# EAGLE design SEMAFORO MOSFET 2 (EAGLE 7.3.0)

## Sheet 1 of 2
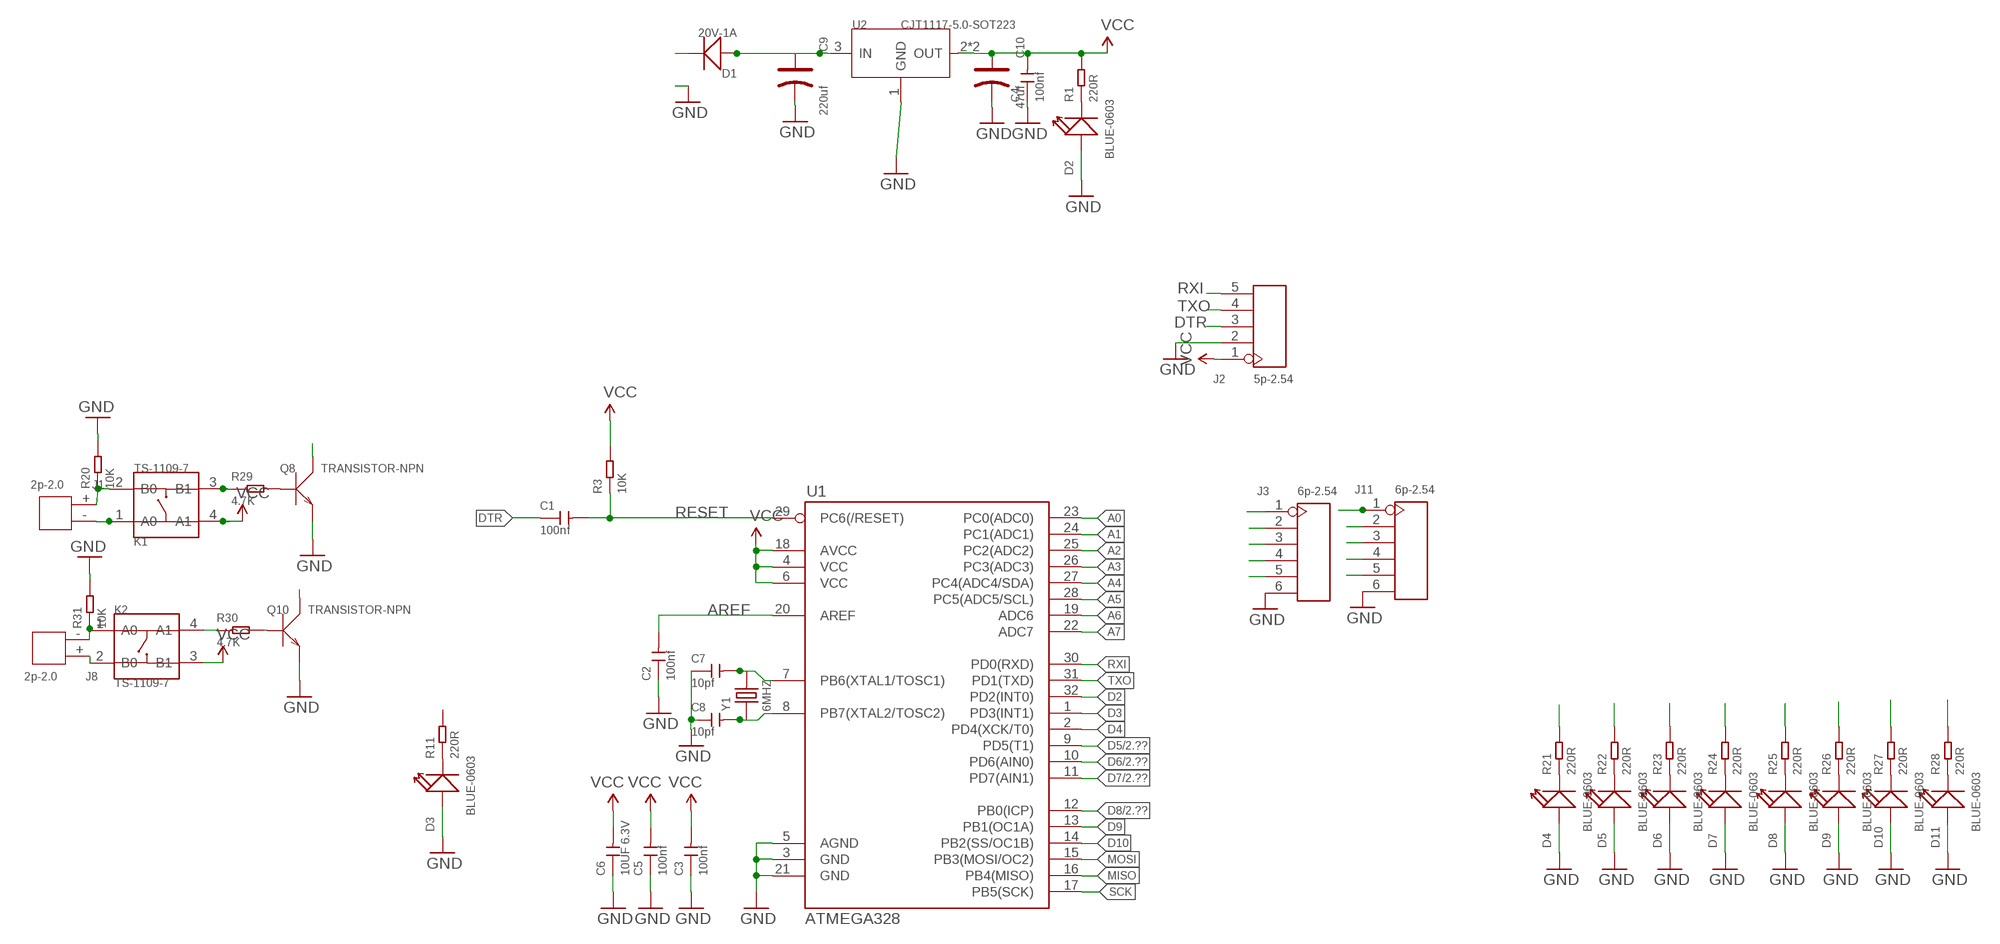
[diagram p0: schematic, sheet 1]

### Parts
C1  100nf  CERAMIC-100NF-50V-10%-X7R(0603)  [C0603]
C2  100nf  CERAMIC-100NF-50V-10%-X7R(0603)  [C0603]
C3  100nf  CERAMIC-100NF-50V-10%-X7R(0603)  [C0603]
C4  100nf  CERAMIC-100NF-50V-10%-X7R(0603)  [C0603]
C5  100nf  CERAMIC-100NF-50V-10%-X7R(0603)  [C0603]
C6  10UF 6.3V  CERAMIC-10UF-6.3V-20%-X5R(0603)  [C0603]
C7  10pf  CERAMIC-10PF-50V-5%-NPO(0603)  [C0603]
C8  10pf  CERAMIC-10PF-50V-5%-NPO(0603)  [C0603]
C9  220uf  DIP-ALUMINUM-100UF-16V(D5-H7MM)  [PC-D5.3MM]
C10  47uf  DIP-ALUMINUM-100UF-16V(D5-H7MM)  [PC-D5.3MM]
D1  20V-1A  SMD-DIODE-SCHOTTKY-20V-1A(SOD-123)  [SOD-123]
D2  BLUE-0603  SMD-LED-CLEAR-BLUE(0603)  [LED-0603]
D3  BLUE-0603  SMD-LED-CLEAR-BLUE(0603)  [LED-0603]
D4  BLUE-0603  SMD-LED-CLEAR-BLUE(0603)  [LED-0603]
D5  BLUE-0603  SMD-LED-CLEAR-BLUE(0603)  [LED-0603]
D6  BLUE-0603  SMD-LED-CLEAR-BLUE(0603)  [LED-0603]
D7  BLUE-0603  SMD-LED-CLEAR-BLUE(0603)  [LED-0603]
D8  BLUE-0603  SMD-LED-CLEAR-BLUE(0603)  [LED-0603]
D9  BLUE-0603  SMD-LED-CLEAR-BLUE(0603)  [LED-0603]
D10  BLUE-0603  SMD-LED-CLEAR-BLUE(0603)  [LED-0603]
D11  BLUE-0603  SMD-LED-CLEAR-BLUE(0603)  [LED-0603]
J1  2p-2.0  DIP-JST-2P-2.0  [H2-2.0-6X4.5MM]
J2  5p-2.54  DIP-BLACK-FEMALE-HEADER-VERT(5P-2.54)  [H5-2.54]
J3  6p-2.54  DIP-LONG-BLUE-FEMALE-HEADER(6P-2.54)  [H6-2.54]
J8  2p-2.0  DIP-JST-2P-2.0  [H2-2.0-6X4.5MM]
J11  6p-2.54  DIP-LONG-BLUE-FEMALE-HEADER(6P-2.54)  [H6-2.54]
K1  TS-1109-7  DIP-BUTTON-TOP-BLACK(4P-D6.2MM)  [SW4-6.2X6.2X5.0MM]
K2  TS-1109-7  DIP-BUTTON-TOP-BLACK(4P-D6.2MM)  [SW4-6.2X6.2X5.0MM]
Q8  TRANSISTOR-NPN  [SOT-23]
Q10  TRANSISTOR-NPN  [SOT-23]
R1  220R  SMD-RES-220R-5%-1/10W(0603)  [R0603]
R3  10K  SMD-RES-10K-1%-1/10W(0603)  [R0603]
R11  220R  SMD-RES-220R-5%-1/10W(0603)  [R0603]
R20  10K  SMD-RES-10K-1%-1/10W(0603)  [R0603]
R21  220R  SMD-RES-220R-5%-1/10W(0603)  [R0603]
R22  220R  SMD-RES-220R-5%-1/10W(0603)  [R0603]
R23  220R  SMD-RES-220R-5%-1/10W(0603)  [R0603]
R24  220R  SMD-RES-220R-5%-1/10W(0603)  [R0603]
R25  220R  SMD-RES-220R-5%-1/10W(0603)  [R0603]
R26  220R  SMD-RES-220R-5%-1/10W(0603)  [R0603]
R27  220R  SMD-RES-220R-5%-1/10W(0603)  [R0603]
R28  220R  SMD-RES-220R-5%-1/10W(0603)  [R0603]
R29  4.7K  SMD-RES-4.7K-5%-1/10W(0603)  [R0603]
R30  4.7K  SMD-RES-4.7K-5%-1/10W(0603)  [R0603]
R31  10K  SMD-RES-10K-1%-1/10W(0603)  [R0603]
U1  ATMEGA328  ATMEGA168  [TQFP32-08]
U2  CJT1117-5.0-SOT223  PMIC-CJT1117-5.0(SOT223)  [SOT-223]
Y1  6MHZ  DIP-CRYSTAL-6MHZ-32PF-30PPM-100R(HC49US)  [HC49US]

### Nets
3.3V: K1.4(A1) K2.3(B1) ; supply symbol labelled VCC
A0: J11.3 U1.23(PC0(ADC0))
A1: J11.2 U1.24(PC1(ADC1))
A2: J3.5 U1.25(PC2(ADC2))
A3: J3.4 U1.26(PC3(ADC3))
A4: J3.3 U1.27(PC4(ADC4/SDA))
A5: J3.2 U1.28(PC5(ADC5/SCL))
A6: J11.5 U1.19(ADC6)
A7: J11.4 U1.22(ADC7)
AREF: C2.2 U1.20(AREF)
D2: Q8.3(C) U1.32(PD2(INT0))
D3: U1.1(PD3(INT1))
D4: U1.2(PD4(XCK/T0))
D5: R21.2 U1.9(PD5(T1)) ; also sheet 2
D6: R22.2 U1.10(PD6(AIN0)) ; also sheet 2
D7: R23.2 U1.11(PD7(AIN1)) ; also sheet 2
D8: R24.2 U1.12(PB0(ICP)) ; also sheet 2
D9: R25.2 U1.13(PB1(OC1A)) ; also sheet 2
D10: R28.2 U1.14(PB2(SS/OC1B)) ; also sheet 2
D22: J1.+ K1.2(B0) R20.1
DTR: C1.1 J2.3
GND [vcc]: C2.1 C3.1 C4.1 C5.1 C6.1 C7.1 C8.1 C9.- C10.- D2.+ D3.+ D4.+ D5.+ D6.+ D7.+ D8.+ D9.+ D10.+ D11.+ J2.2 J3.6 J11.6 Q8.2(E) Q10.2(E) R20.2 R31.2 U1.3(GND) U1.5(AGND) U1.21(GND) U2.1(GND) ; also sheet 2
MISO: R26.2 U1.16(PB4(MISO)) ; also sheet 2
MOSI: R27.2 U1.15(PB3(MOSI/OC2)) ; also sheet 2
N$1: C8.2 U1.8(PB7(XTAL2/TOSC2)) Y1.1
N$2: C7.2 U1.7(PB6(XTAL1/TOSC1)) Y1.2
N$5: D2.- R1.1
N$7: D4.- R21.1
N$12: C9.+ D1.+ U2.3(IN)
N$13: D3.- R11.1
N$15: J8.- K2.1(A0) R31.1
N$16: J8.+ K2.2(B0)
N$18: D5.- R22.1
N$19: D6.- R23.1
N$21: D7.- R24.1
N$22: D8.- R25.1
N$23: D9.- R26.1
N$24: D10.- R27.1
N$25: D11.- R28.1
N$27: D1.-
N$40: K2.4(A1) R30.1
N$41: K1.3(B1) R29.1
N$42: Q10.1(B) R30.2
N$43: Q8.1(B) R29.2
RESET: C1.2 Q10.3(C) R3.1 U1.29(PC6(/RESET))
RXI: J2.5 U1.30(PD0(RXD))
SCK: U1.17(PB5(SCK))
TXO: J2.4 U1.31(PD1(TXD))
VCC: C3.2 C4.2 C5.2 C6.2 C10.+ J1.- J2.1 J3.1 J11.1 K1.1(A0) R1.2 R3.2 U1.4(VCC) U1.6(VCC) U1.18(AVCC) U2.2(OUT) U2.TER(OUT)
Unconnected: R11.2

## Sheet 2 of 2
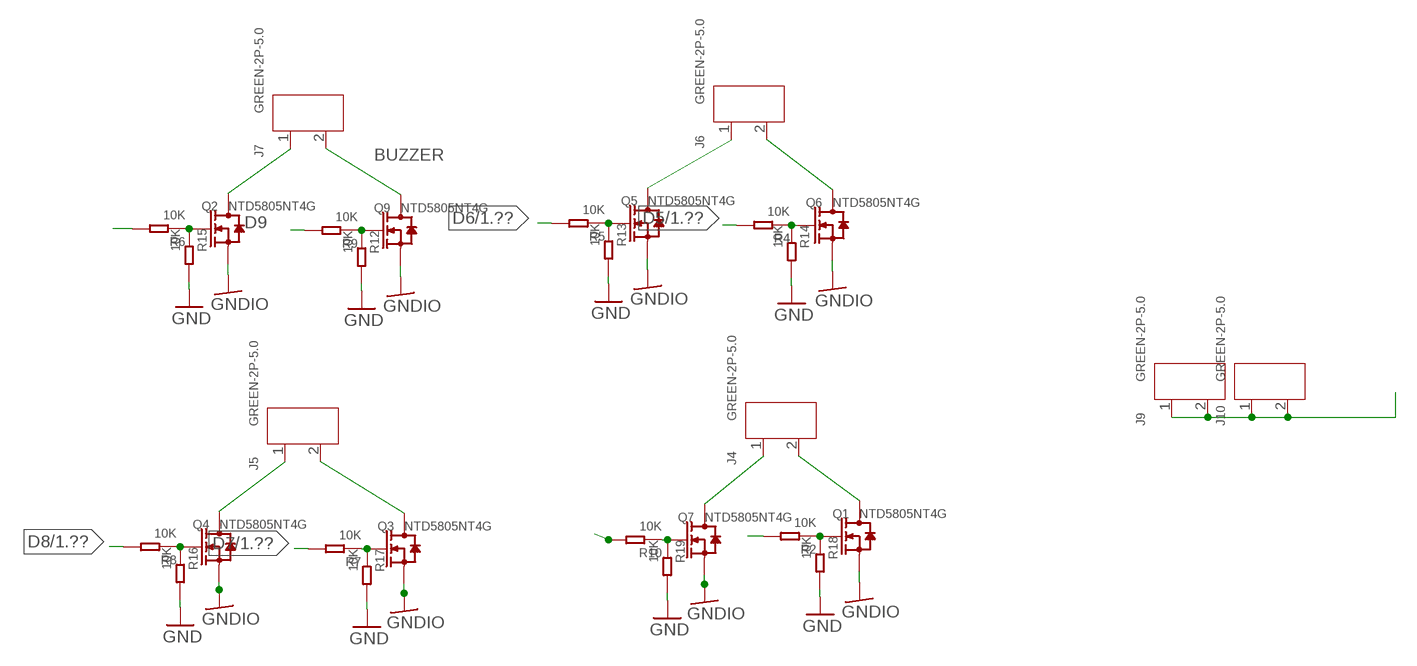
[diagram p1: schematic, sheet 2]

### Parts
J4  GREEN-2P-5.0  SCREW-TERMINAL-GREEN(2P-5.0)  [H2-5.0-10.5X8.0MM]
J5  GREEN-2P-5.0  SCREW-TERMINAL-GREEN(2P-5.0)  [H2-5.0-10.5X8.0MM]
J6  GREEN-2P-5.0  SCREW-TERMINAL-GREEN(2P-5.0)  [H2-5.0-10.5X8.0MM]
J7  GREEN-2P-5.0  SCREW-TERMINAL-GREEN(2P-5.0)  [H2-5.0-10.5X8.0MM]
J9  GREEN-2P-5.0  SCREW-TERMINAL-GREEN(2P-5.0)  [H2-5.0-10.5X8.0MM]
J10  GREEN-2P-5.0  SCREW-TERMINAL-GREEN(2P-5.0)  [H2-5.0-10.5X8.0MM]
Q1  NTD5805NT4G  SMD-MOSFET-HIGH-POWER-N-CH-40V-51A-NTD5805NT4G(DPAK)  [DPAK]
Q2  NTD5805NT4G  SMD-MOSFET-HIGH-POWER-N-CH-40V-51A-NTD5805NT4G(DPAK)  [DPAK]
Q3  NTD5805NT4G  SMD-MOSFET-HIGH-POWER-N-CH-40V-51A-NTD5805NT4G(DPAK)  [DPAK]
Q4  NTD5805NT4G  SMD-MOSFET-HIGH-POWER-N-CH-40V-51A-NTD5805NT4G(DPAK)  [DPAK]
Q5  NTD5805NT4G  SMD-MOSFET-HIGH-POWER-N-CH-40V-51A-NTD5805NT4G(DPAK)  [DPAK]
Q6  NTD5805NT4G  SMD-MOSFET-HIGH-POWER-N-CH-40V-51A-NTD5805NT4G(DPAK)  [DPAK]
Q7  NTD5805NT4G  SMD-MOSFET-HIGH-POWER-N-CH-40V-51A-NTD5805NT4G(DPAK)  [DPAK]
Q9  NTD5805NT4G  SMD-MOSFET-HIGH-POWER-N-CH-40V-51A-NTD5805NT4G(DPAK)  [DPAK]
R2  10K  SMD-RES-10K-1%-1/10W(0603)  [R0603]
R4  10K  SMD-RES-10K-1%-1/10W(0603)  [R0603]
R5  10K  SMD-RES-10K-1%-1/10W(0603)  [R0603]
R6  10K  SMD-RES-10K-1%-1/10W(0603)  [R0603]
R7  10K  SMD-RES-10K-1%-1/10W(0603)  [R0603]
R8  10K  SMD-RES-10K-1%-1/10W(0603)  [R0603]
R9  10K  SMD-RES-10K-1%-1/10W(0603)  [R0603]
R10  10K  SMD-RES-10K-1%-1/10W(0603)  [R0603]
R12  10K  SMD-RES-10K-1%-1/10W(0603)  [R0603]
R13  10K  SMD-RES-10K-1%-1/10W(0603)  [R0603]
R14  10K  SMD-RES-10K-1%-1/10W(0603)  [R0603]
R15  10K  SMD-RES-10K-1%-1/10W(0603)  [R0603]
R16  10K  SMD-RES-10K-1%-1/10W(0603)  [R0603]
R17  10K  SMD-RES-10K-1%-1/10W(0603)  [R0603]
R18  10K  SMD-RES-10K-1%-1/10W(0603)  [R0603]
R19  10K  SMD-RES-10K-1%-1/10W(0603)  [R0603]

### Nets
BUZZER: J7.2 Q9.3(D)
D5: R4.2 ; also sheet 1
D6: R5.2 ; also sheet 1
D7: R7.2 ; also sheet 1
D8: R8.2 ; also sheet 1
D9: R9.2 ; also sheet 1
D10: R6.2 ; also sheet 1
GND [vcc]: R12.2 R13.2 R14.2 R15.2 R16.2 R17.2 R18.2 R19.2 ; also sheet 1
GNDIO [vcc]: Q1.2(S) Q2.2(S) Q3.2(S) Q4.2(S) Q5.2(S) Q6.2(S) Q7.2(S) Q9.2(S)
MISO: R10.2 ; also sheet 1
MOSI: R2.2 ; also sheet 1
N$3: J9.1 J9.2 J10.1 J10.2
N$4: J4.1 Q7.3(D)
N$6: Q1.1(G) R2.1 R18.1
N$8: Q6.1(G) R4.1 R14.1
N$9: Q9.1(G) R9.1 R12.1
N$10: Q7.1(G) R10.1 R19.1
N$11: Q5.1(G) R5.1 R13.1
N$14: Q2.1(G) R6.1 R15.1
N$17: Q3.1(G) R7.1 R17.1
N$20: Q4.1(G) R8.1 R16.1
R1: J5.1 Q4.3(D)
R2: J5.2 Q3.3(D)
R3: J6.1 Q5.3(D)
V1: J6.2 Q6.3(D)
V2: J4.2 Q1.3(D)
V3: J7.1 Q2.3(D)

## Library data of the parts
C1-C5 = Seeed-OPL-Capacitor:CERAMIC-100NF-50V-10%-X7R(0603): 302010138; MPN: CC0603KRX7R9BB104
C6 = Seeed-OPL-Capacitor:CERAMIC-10UF-6.3V-20%-X5R(0603): 302010286; MPN: CC0603MRX5R5BB106
C7 C8 = Seeed-OPL-Capacitor:CERAMIC-10PF-50V-5%-NPO(0603): 302010097
C9 C10 = Seeed-OPL-Capacitor:DIP-ALUMINUM-100UF-16V(D5-H7MM): 302030031; VALUE: 100uf
D1 = Seeed-OPL-Diode:SMD-DIODE-SCHOTTKY-20V-1A(SOD-123): 304020034; MPN: B5819W
D2-D11 = Seeed-OPL-Diode:SMD-LED-CLEAR-BLUE(0603): 304090045; MPN: 19-217-BHC-ZL1M2RY-3T
J1 J8 = Seeed-Connector -2016:DIP-JST-2P-2.0: 320110049
J2 = Seeed-OPL-Connector:DIP-BLACK-FEMALE-HEADER-VERT(5P-2.54): 320030028; MPN: F185-1105A0BSYA1
J3 J11 = Seeed-OPL-Connector:DIP-LONG-BLUE-FEMALE-HEADER(6P-2.54): 320030067
J4-J7 J9 J10 = Seeed-Connector -2016:SCREW-TERMINAL-GREEN(2P-5.0): 320110031
K1 K2 = Seeed-OPL-Switch:DIP-BUTTON-TOP-BLACK(4P-D6.2MM): 311020032; MPN: TS-1109-7
Q1-Q7 Q9 = Seeed-OPL-Transistor:SMD-MOSFET-HIGH-POWER-N-CH-40V-51A-NTD5805NT4G(DPAK): 305030078; MPN: NTD5805NT4G
Q8 Q10 = Seeed-OPL-Transistor:TRANSISTOR-NPN*: NPN Transistor
R1 R11 R21-R28 = Seeed-OPL-Resistor:SMD-RES-220R-5%-1/10W(0603): 301010163; MPN: RC0603JR-07220RL
R2-R10 R12-R20 R31 = Seeed-OPL-Resistor:SMD-RES-10K-1%-1/10W(0603): 301010299; MPN: RC0603FR-0710KL
R29 R30 = Seeed-OPL-Resistor:SMD-RES-4.7K-5%-1/10W(0603): 301010290; MPN: RC0603JR-074K7L
U1 = SparkFun:ATMEGA168
U2 = Seeed-OPL-ic:PMIC-CJT1117-5.0(SOT223): 310030096; MPN: CJT1117-5.0
Y1 = Seeed-OPL-Crystal-Oscillator:DIP-CRYSTAL-6MHZ-32PF-30PPM-100R(HC49US): 306010044; MPN: HC49/US

## Net classes
1 vcc: width 0.254 mm

## Board
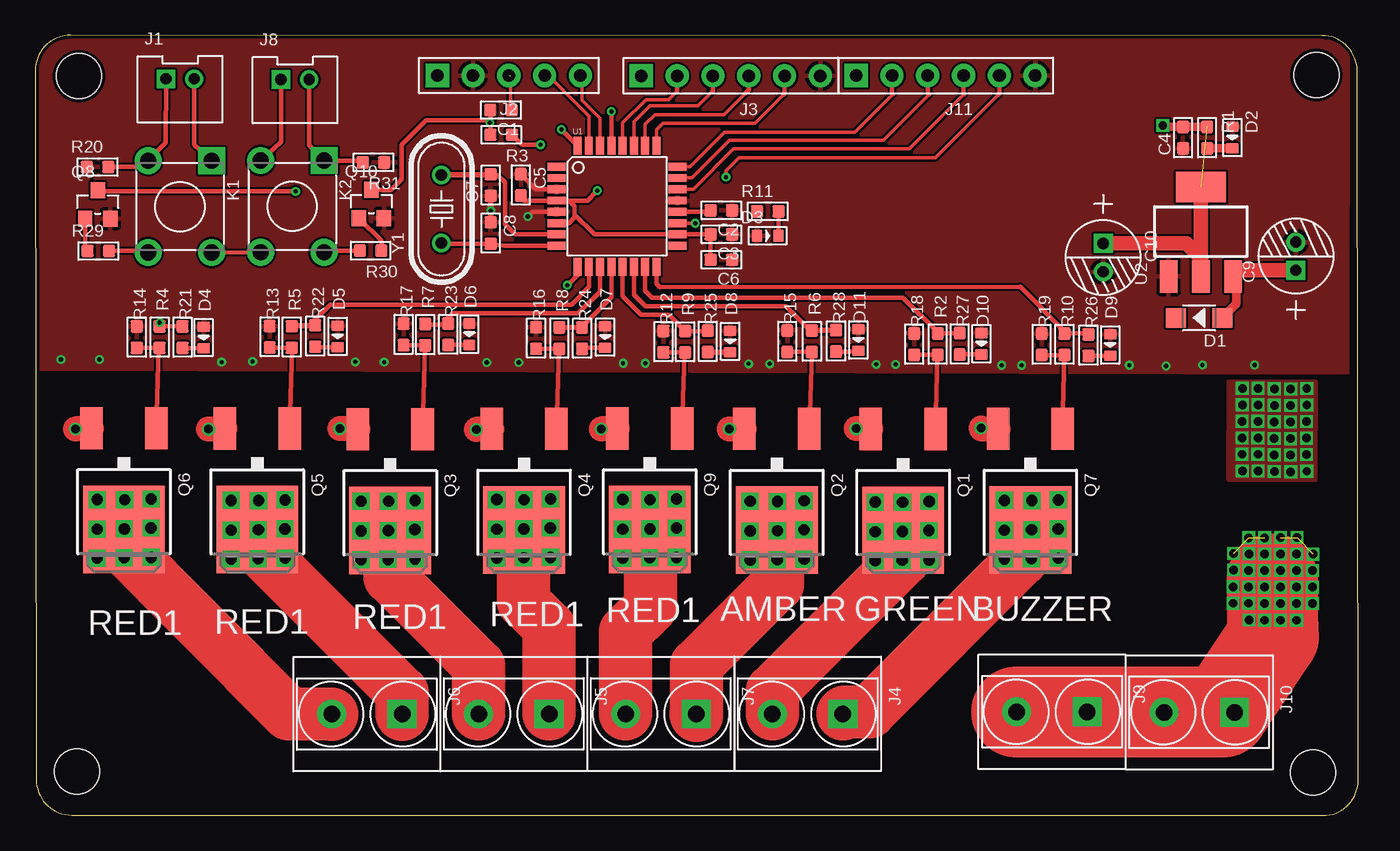
[diagram p2: board, top side]
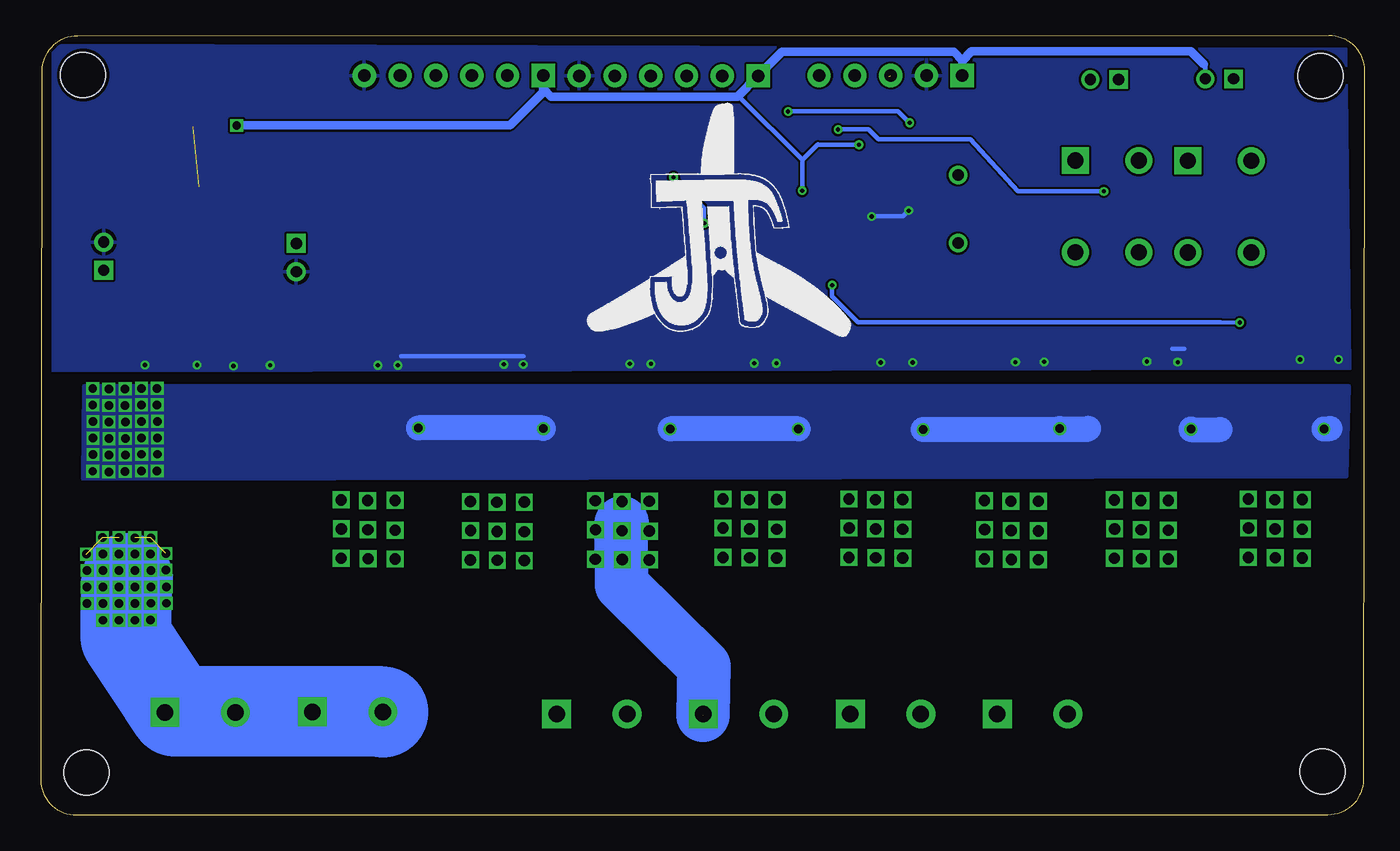
[diagram p3: board, bottom side, seen from below]

Size 93.85 x 55.32 mm. Coordinates in mm from the lower left corner, seen from the top.
Outline: 0,52.82 0.08,2.53 arc90 2.58,0.03 91.35,0 arc90 93.85,2.5 93.78,52.8 arc90 91.28,55.3 2.5,55.32 arc90 0,52.82
Copper layers (1*16): Top 0.035mm / dielectric 1.5mm / Bottom 0.035mm
Design rules "SeeedStudio_2layer_DRU_no_angle_20140221": minimum track width 6mil, minimum drill 12mil, track to track 6mil, track to pad 6mil, pad to pad 6mil, via to via 6mil, smd to smd 0mil, copper to edge 10mil, drill to drill 10mil, minimum pad ring 10mil, minimum via ring 6mil, stop-mask expansion 2mil, vias tented up to drill 100mil, thermal gap 10mil
Holes 3.2 mm at 3.1,52.42 90.88,52.5 90.64,3.05 2.98,3.13

### Footprints (pad centres in the part's own frame; a part is rotated, then mirrored left to right if it is on the bottom)
C0603 = smd 0.889 x 0.889: 1 0,0.762; 2 0,-0.762
PC-D5.3MM = drill 0.8 pad 1.35 square: + -1,0 | drill 0.8 pad 1.35: - 1,0
SOD-123 = smd 1.397 x 1.397: + -1.651,0; - 1.651,0
LED-0603 = smd 0.762 x 0.889: + -0.762,0; - 0.762,0
H2-2.0-6X4.5MM = drill 0.8 pad 1.3 square: + -1,0.75 | drill 0.8 pad 1.3: - 1,0.75
H5-2.54 = drill 0.889 pad 1.651 square: 1 0,5.08 | drill 0.889 pad 1.651: 2 0,2.54; 3 0,0; 4 0,-2.54; 5 0,-5.08
H6-2.54 = drill 0.889 pad 1.651 square: 1 0,6.35 | drill 0.889 pad 1.651: 2 0,3.81; 3 0,1.27; 4 0,-1.27; 5 0,-3.81; 6 0,-6.35
H2-5.0-10.5X8.0MM = drill 1.168 pad 2.032 square: 1 0,2.5 | drill 1.168 pad 2.032: 2 0,-2.5
SW4-6.2X6.2X5.0MM = drill 1.143 pad 1.905 square: 1 -3.25,2.25 | drill 1.143 pad 1.905: 2 -3.25,-2.25; 3 3.25,-2.25; 4 3.25,2.25
DPAK = smd 3 x 1.6: 1 0,-2.3; 2 0,2.3 | smd 6.2 x 5.8: 3 -7.18,0
SOT-23 = smd 1.016 x 1.143: 1 -0.889,-1.016; 2 0.889,-1.016; 3 0,1.016
R0603 = smd 0.889 x 0.889: 1 0,0.762; 2 0,-0.762
TQFP32-08 = smd 1.27 x 0.559: 1 -4.293,2.8; 2 -4.293,2; 3 -4.293,1.2; 4 -4.293,0.4; 5 -4.293,-0.4; 6 -4.293,-1.2; 7 -4.293,-2; 8 -4.293,-2.8; 17 4.293,-2.8; 18 4.293,-2; 19 4.293,-1.2; 20 4.293,-0.4; 21 4.293,0.4; 22 4.293,1.2; 23 4.293,2; 24 4.293,2.8 | smd 0.559 x 1.27: 9 -2.8,-4.293; 10 -2,-4.293; 11 -1.2,-4.293; 12 -0.4,-4.293; 13 0.4,-4.293; 14 1.2,-4.293; 15 2,-4.293; 16 2.8,-4.293; 25 2.8,4.293; 26 2,4.293; 27 1.2,4.293; 28 0.4,4.293; 29 -0.4,4.293; 30 -1.2,4.293; 31 -2,4.293; 32 -2.8,4.293
SOT-223 = smd 1.27 x 2.286: 1 -2.286,-3.175; 2 0,-3.175; 3 2.286,-3.175 | smd 3.556 x 2.159: TER 0,3.175
HC49US = drill 0.813: 1 -2.413,0; 2 2.413,0

### Placement (x,y rotation side)
C1  33.03,50.02 270 top
C2  48.67,42.9 270 top
C3  48.67,41.2 270 top
C4  81.43,48.06 180 top
C5  34.45,44.71 0 top
C6  48.67,39.4 270 top
C7  32.31,44.7 180 top
C8  32.31,41.3 0 top
C9  89.42,39.66 90 top
C10  75.76,39.56 270 top
D1  82.56,35.28 180 top
D2  84.93,48.06 270 top
D3  51.95,41.1 0 top
D4  11.94,33.88 270 top
D5  21.46,33.97 270 top
D6  30.79,34.12 270 top
D7  40.43,33.92 270 top
D8  49.29,33.61 270 top
D9  76.26,33.36 270 top
D10  67.13,33.45 270 top
D11  58.39,33.71 270 top
J1  10.28,51.48 0 top
J2  33.6,52.46 90 top
J3  49.35,52.44 90 top
J4  54.79,7.19 270 top
J5  33.95,7.19 270 top
J6  23.53,7.18 270 top
J7  44.38,7.19 270 top
J8  18.43,51.42 0 top
J9  72.13,7.35 270 top
J10  82.57,7.31 270 top
J11  64.59,52.46 90 top
K1  10.27,43.16 270 top
K2  18.23,43.19 270 top
Q1  61.58,27.4 90 top
Q2  52.61,27.41 90 top
Q3  25.18,27.39 90 top
Q4  34.68,27.41 90 top
Q5  15.75,27.44 90 top
Q6  6.29,27.45 90 top
Q7  70.59,27.41 90 top
Q8  4.44,43.31 0 top
Q9  43.59,27.44 90 top
Q10  23.84,43.35 0 top
R1  83.12,48.06 180 top
R2  64.01,33.42 180 top
R3  33.06,48.27 90 top
R4  8.82,33.91 180 top
R5  18.2,33.92 180 top
R6  55.09,33.62 180 top
R7  27.66,34.09 180 top
R8  37.17,33.85 180 top
R9  46.1,33.59 180 top
R10  73.01,33.41 180 top
R11  51.97,42.83 270 top
R12  44.56,33.6 180 top
R13  16.63,33.94 180 top
R14  7.21,33.92 180 top
R15  53.35,33.62 180 top
R16  35.53,33.85 180 top
R17  26.13,34.11 180 top
R18  62.35,33.42 180 top
R19  71.39,33.41 180 top
R20  4.43,45.98 270 top
R21  10.45,33.92 180 top
R22  19.86,33.99 180 top
R23  29.29,34.12 180 top
R24  38.79,33.84 180 top
R25  47.71,33.61 180 top
R26  74.72,33.34 180 top
R27  65.58,33.43 180 top
R28  56.81,33.65 180 top
R29  4.48,40.02 270 top
R30  23.79,40.05 90 top
R31  24,46.31 90 top
U1  41.27,43.2 0 top
U2  82.68,41.4 0 top
Y1  28.81,43 90 top

### Tracks (layer width: path | path; a pad name or v marks a point on that pad's centre or on a via)
3.3V
  Top 0.305: K1.4 15.77,39.93 K2.3
A0
  Top 0.254: U1.23 46.58,45.2 49.26,47.87 60.15,47.87 63.43,51.15
  Top 0.305: J11.3 63.32,51.26 63.43,51.15
A1
  Top 0.254: 60.83,51.14 58.13,48.44 48.9,48.44 46.46,46 U1.24
  Top 0.305: J11.2 60.78,51.19 60.83,51.14
A2
  Top 0.254: U1.25 44.07,48.62 44.52,49.07 51.05,49.07 53.08,51.1
  Top 0.305: J3.5 53.16,51.17 53.08,51.1
A3
  Top 0.254: U1.26 43.27,49.01 43.96,49.7 48.85,49.7 50.37,51.23
  Top 0.305: J3.4 50.62,51.47 50.37,51.23
A4
  Top 0.254: U1.27 42.47,49.19 43.6,50.32 47.01,50.32 48,51.31
  Top 0.305: J3.3 48.08,51.39 48,51.31
A5
  Top 0.254: U1.28 41.67,49.1 43.31,50.74 44.93,50.74 45.52,51.34
  Top 0.305: J3.2 45.54,51.35 45.52,51.34
A6  (via drill 0.3)
  Top 0.254: U1.19 46.81,42 v46.82,41.99 | v49,45.26 49,45.73 49.92,46.64 63.86,46.64 68.33,51.11
  Top 0.305: J11.5 68.4,51.17 68.33,51.11
  Bottom 0.254: v46.82,41.99 46.82,43.07 v49,45.26
A7
  Top 0.254: U1.22 46.68,44.4 49.55,47.26 62.01,47.26 65.87,51.12
  Top 0.305: J11.4 65.86,51.14 65.87,51.12
AREF
  Top 0.305: U1.20 47.81,42.8 C2.2
BUZZER
  Top 3.81: J7.2 41.88,13.01 43.64,14.78 43.64,20.21 Q9.3
D2  (via drill 0.3)
  Top 0.305: U1.32 v37.33,48.63 | Q8.3 4.76,44.25 v18.47,44.25
  Bottom 0.305: v18.47,44.25 24.58,44.25 27.95,47.94 34.45,47.95 35.17,48.67 37.29,48.67 v37.33,48.63
D5  (via drill 0.3)
  Top 0.305: U1.9 38.47,38.32 v37.75,37.6 | v8.83,34.94 9.07,34.93 R4.2 R21.2
  Bottom 0.305: v37.75,37.6 37.75,36.8 35.93,34.98 10.17,34.98 v8.83,34.94
D6
  Top 0.305: U1.10 39.27,37.5 38.04,36.23 20.94,36.23 19.36,34.7 18.22,34.7 R5.2 18.27,34.75 R22.2
D7
  Top 0.305: U1.11 40.07,37.15 38.51,35.59 29.6,35.59 28.81,34.8 | 28.81,34.8 27.71,34.8 R7.2 | 28.81,34.8 29.22,34.8 R23.2
D8
  Top 0.305: U1.12 40.87,36.74 38.7,34.58 37.2,34.58 R8.2 R24.2
D9
  Top 0.305: 46.08,34.37 R9.2 | U1.13 41.67,36.82 42.98,35.5 44.95,35.5 R9.2 | R9.2 47.68,34.35 R25.2
D10
  Top 0.305: R6.2 55.03,34.44 54.93,34.44 53.27,36.1 43.29,36.1 42.47,36.92 U1.14
  Top 0.406: R6.2 56.81,34.39 R28.2
D22
  Top 0.305: R20.1 7.47,45.98 K1.2 9.26,47.71 J1.+
DTR  (1 unrouted)
  Top 0.254: 33.73,50.09 33.73,52.42
  Top 0.305: C1.1 33.73,50.09
GND  (via drill 0.3)
  Top 0.305: U1.5 35.27,42.8 v34.94,42.48 | U1.3 35.51,44.4 C5.1
  Top 0.406: C8.1 v32.31,42.88 C7.1
  Bottom 0.305: v34.94,42.48 32.72,42.48 v32.31,42.88 | 13.62,33.1 12.76,33.1 | 68.32,32.57 59.62,32.57
  other vias: 1.82,32.33 4.55,32.33 13.23,32.14 15.42,32.19 22.7,32.16 24.75,32.14 32.04,32.11 34.3,32.12 41.7,32.06 43.27,32.06 50.6,32.02 52.1,32.02 59.65,31.99 61.04,31.99 68.55,31.92 69.98,31.92 77.62,31.92 80.22,31.86 82.8,31.95 86.51,31.93
  pour Top: 0.28,55.2 93.12,55.16 93.08,31.38 -0.03,31.69
  pour Bottom: 1.28,54.36 1.01,31.67 93.05,31.5 93.02,54.64
GNDIO  (via drill 0.6)
  Top 1.778: Q6.2 3.94,27.4 v2.85,27.4 | Q5.2 13.4,27.39 v12.3,27.39 | Q3.2 22.84,27.43 v21.6,27.43 | v31.29,27.35 31.35,27.41 Q4.2 | Q9.2 41.25,27.4 v40.15,27.4 | v49.24,27.4 49.26,27.41 Q2.2 | Q1.2 59.25,27.43 v58.22,27.43 | v67.09,27.48 67.15,27.41 Q7.2
  Bottom 1.778: v2.85,27.4 2.44,27.43 | v12.3,27.39 12.27,27.36 10.23,27.36 | v21.6,27.43 19.55,27.43 19.56,27.44 19.61,27.44 19.7,27.35 v31.29,27.35 | v40.15,27.4 v49.24,27.4 | v58.22,27.43 58.27,27.48 v67.09,27.48
  other vias: 87.89,26.73 87.89,25.57 87.9,24.38 87.9,30.25 87.89,27.91 87.9,29.08 86.73,26.77 86.73,25.61 86.75,24.42 86.75,30.28 86.73,27.95 86.75,29.12 85.62,26.77 85.62,25.61 85.63,24.42 85.63,30.28 85.62,27.95 85.63,29.12 90.19,26.75 90.19,25.6 90.2,24.4 90.2,30.27 90.19,27.93 90.2,29.1 89.05,26.71 89.05,25.56 89.06,24.37 89.06,30.23 89.05,27.9 89.06,29.06
  pour Bottom: 1.09,30.44 90.8,30.42 90.86,23.87 1.29,24.06
  pour Top: 90.8,30.72 84.7,30.74 84.68,23.83 90.77,23.81
MISO
  Top 0.305: 73.16,34.19 69.87,37.48 44.32,37.46 44.07,37.71 U1.16 | 73.16,34.19 72.96,34.12 R10.2 | 73.16,34.19 74.63,34.19 R26.2
MOSI
  Top 0.305: U1.15 43.27,37.21 43.76,36.72 61.56,36.72 64.06,34.22 63.98,34.22 R2.2 64.03,34.19 R27.2
N$1
  Top 0.305: U1.8 33.25,40.4 C8.2 28.86,40.54 Y1.1
N$2
  Top 0.305: U1.7 34.05,41.2 33.34,41.91 33.34,44.91 32.81,45.4 32.27,45.4 C7.2
  Top 0.406: Y1.2 31.96,45.41 C7.2
N$3
  Top 0.61: J10.2 J10.1 84.07,7.31 83.98,7.4 80.94,7.4 80.89,7.35
  Top 6.452: J9.2 J9.1 80.89,7.35 84.27,7.35 87.83,12.67 87.76,16.74 87.74,16.73
  Bottom 6.452: J9.2 84.36,7.4 87.83,12.64 87.79,16.76 87.74,16.81
N$4
  Top 3.81: Q7.3 69.96,18.12 59.16,7.33 57.4,7.3 J4.1
N$5
  Top 0.61: D2.- R1.1
N$6
  Top 0.305: Q1.1 64.19,27.08 64.19,26.98 63.85,27.32 R2.1 R18.1
N$7
  Top 0.305: D4.- 10.48,33.12 R21.1
N$8
  Top 0.305: Q6.1 8.76,33.09 R4.1 7.15,33.15 R14.1
N$9
  Top 0.305: Q9.1 46.06,32.78 R9.1 44.47,32.82 R12.1
N$10
  Top 0.305: Q7.1 72.85,27.46 R10.1 71.3,32.65 R19.1
N$11
  Top 0.305: Q5.1 18.22,33.14 R5.1 16.65,33.16 R13.1
N$12
  Top 0.61: D1.+ 85.21,36.28 85.21,37.98 U2.3
  Top 1.016: C9.+ 85.41,38.66 U2.3
N$13
  Top 0.305: D3.- 52.71,42.81 R11.1
N$14
  Top 0.305: Q2.1 54.92,27.42 R6.1 R15.1
N$15
  Top 0.305: J8.- 19.43,47.53 K2.1 23.11,46.44 R31.1
N$16
  Top 0.305: K2.2 17.43,47.78 J8.+
N$17
  Top 0.305: Q3.1 27.64,33.31 R7.1 25.97,33.33 R17.1
N$18
  Top 0.305: D5.- 19.88,33.2 R22.1
N$19
  Top 0.305: D6.- R23.1
N$20
  Top 0.305: Q4.1 37.14,33.05 R8.1 35.62,33.08 R16.1
N$21
  Top 0.305: D7.- 38.87,33.15 R24.1
N$22
  Top 0.406: R25.1 D8.-
N$23
  Top 0.305: R26.1 76.24,32.58 D9.-
N$24
  Top 0.305: D10.- 65.59,32.68 R27.1
N$25
  Top 0.305: D11.- 57.6,32.86 R28.1
N$26
  Top 0.305: 38.61,34.54 38.58,34.54 38.58,34.55
N$30  (via drill 0.8)
  other vias: 50.72,22.27
N$31  (via drill 0.8)
  other vias: 54.54,22.31
N$32  (via drill 0.8)
  other vias: 50.72,20.16
N$33  (via drill 0.8)
  other vias: 4.4,22.4
N$34  (via drill 0.8)
  other vias: 50.72,18.12
N$35  (via drill 0.8)
  other vias: 52.66,22.26
N$36  (via drill 0.8)
  other vias: 52.65,20.19
N$37  (via drill 0.8)
  other vias: 52.63,18.14
N$38  (via drill 0.8)
  other vias: 54.53,20.25
N$39  (via drill 0.8)
  other vias: 54.54,18.17
N$40
  Top 0.305: R30.1 20.59,40.05 K2.4
N$41
  Top 0.305: R29.1 7.9,40.05 K1.3
N$42
  Top 0.305: R30.2 24.55,40.74 Q10.1
N$43
  Top 0.305: Q8.1 3.55,40.14 R29.2
N$44  (via drill 0.8)
  other vias: 8.22,22.43
N$45  (via drill 0.8)
  other vias: 4.4,20.29
N$46  (via drill 0.8)
  other vias: 4.4,18.24
N$47  (via drill 0.8)
  other vias: 6.34,22.38
N$48  (via drill 0.8)
  other vias: 6.33,20.31
N$49  (via drill 0.6)
  other vias: 85.01,17.39
N$50  (via drill 0.6)
  other vias: 86.1,18.55
N$51  (via drill 0.6)
  other vias: 86.09,17.38
N$52  (via drill 0.6)
  other vias: 86.09,16.2
N$53  (via drill 0.6)
  other vias: 86.09,15.04
N$54  (via drill 0.6)
  other vias: 86.1,13.85
N$55  (via drill 0.6)  (2 unrouted)
  other vias: 87.22,19.68 86.09,19.68 85.01,18.57
N$56  (via drill 0.6)
  other vias: 87.22,18.54
N$57  (via drill 0.6)
  other vias: 87.2,17.37
N$58  (via drill 0.6)
  other vias: 87.2,16.19
N$59  (via drill 0.6)
  other vias: 87.2,15.03
N$60  (via drill 0.6)
  other vias: 87.22,13.84
N$61  (via drill 0.6)  (2 unrouted)
  other vias: 88.33,19.7 90.65,18.52 89.52,19.7
N$62  (via drill 0.6)
  other vias: 88.35,18.54
N$63  (via drill 0.6)
  other vias: 88.33,17.37
N$64  (via drill 0.6)
  other vias: 88.33,16.19
N$65  (via drill 0.6)
  other vias: 88.33,15.03
N$66  (via drill 0.6)
  other vias: 88.35,13.84
N$67  (via drill 0.6)
  other vias: 84.97,15.04
N$68  (via drill 0.6)
  other vias: 89.49,18.54
N$69  (via drill 0.6)
  other vias: 89.48,17.37
N$70  (via drill 0.6)
  other vias: 89.48,16.19
N$71  (via drill 0.6)
  other vias: 89.48,15.03
N$72  (via drill 0.6)
  other vias: 89.49,13.84
N$73  (via drill 0.6)
  other vias: 84.97,16.21
N$74  (via drill 0.8)
  other vias: 6.32,18.27
N$75  (via drill 0.6)
  other vias: 90.59,17.37
N$76  (via drill 0.6)
  other vias: 90.59,16.19
N$77  (via drill 0.6)
  other vias: 90.59,15.03
N$78  (via drill 0.8)
  other vias: 8.21,20.38
N$79  (via drill 0.8)
  other vias: 8.22,18.29
N$80  (via drill 0.8)
  other vias: 13.9,22.33
N$81  (via drill 0.8)
  other vias: 17.72,22.37
N$82  (via drill 0.8)
  other vias: 13.9,20.23
N$83  (via drill 0.8)
  other vias: 13.9,18.18
N$84  (via drill 0.8)
  other vias: 15.84,22.32
N$85  (via drill 0.8)
  other vias: 15.83,20.25
N$86  (via drill 0.8)
  other vias: 15.82,18.21
N$87  (via drill 0.8)
  other vias: 17.71,20.31
N$88  (via drill 0.8)
  other vias: 17.72,18.23
N$89  (via drill 0.8)
  other vias: 23.12,22.28
N$90  (via drill 0.8)
  other vias: 26.94,22.32
N$91  (via drill 0.8)
  other vias: 23.12,20.17
N$92  (via drill 0.8)
  other vias: 23.12,18.13
N$93  (via drill 0.8)
  other vias: 25.06,22.27
N$94  (via drill 0.8)
  other vias: 25.05,20.2
N$95  (via drill 0.8)
  other vias: 25.04,18.15
N$96  (via drill 0.8)
  other vias: 26.93,20.26
N$97  (via drill 0.8)
  other vias: 26.94,18.18
N$98  (via drill 0.8)
  other vias: 32.73,22.4
N$99  (via drill 0.8)
  other vias: 36.56,22.43
N$100  (via drill 0.8)
  other vias: 32.73,20.29
N$101  (via drill 0.8)
  other vias: 32.73,18.24
N$102  (via drill 0.8)
  other vias: 34.68,22.38
N$103  (via drill 0.8)
  other vias: 34.66,20.31
N$104  (via drill 0.8)
  other vias: 34.65,18.27
N$105  (via drill 0.8)
  other vias: 36.54,20.38
N$106  (via drill 0.8)
  other vias: 36.56,18.29
N$107  (via drill 0.8)
  other vias: 41.67,22.4
N$108  (via drill 0.8)
  other vias: 45.5,22.43
N$109  (via drill 0.8)
  other vias: 41.67,20.29
N$110  (via drill 0.8)
  other vias: 41.67,18.24
N$111  (via drill 0.8)
  other vias: 43.62,22.38
N$112  (via drill 0.8)
  other vias: 43.61,20.31
N$113  (via drill 0.8)
  other vias: 43.59,18.27
N$114  (via drill 0.8)
  other vias: 45.48,20.38
N$115  (via drill 0.8)
  other vias: 45.5,18.29
N$116  (via drill 0.8)
  other vias: 59.58,22.22
N$117  (via drill 0.8)
  other vias: 63.4,22.26
N$118  (via drill 0.8)
  other vias: 59.58,20.11
N$119  (via drill 0.8)
  other vias: 59.58,18.07
N$120  (via drill 0.8)
  other vias: 61.52,22.21
N$121  (via drill 0.8)
  other vias: 61.51,20.14
N$122  (via drill 0.8)
  other vias: 61.5,18.09
N$123  (via drill 0.8)
  other vias: 63.39,20.2
N$124  (via drill 0.8)
  other vias: 63.4,18.12
N$125  (via drill 0.8)
  other vias: 68.75,22.33
N$126  (via drill 0.8)
  other vias: 72.57,22.37
N$127  (via drill 0.8)
  other vias: 68.75,20.23
N$128  (via drill 0.8)
  other vias: 68.75,18.18
N$129  (via drill 0.8)
  other vias: 70.69,22.32
N$130  (via drill 0.8)
  other vias: 70.68,20.25
N$131  (via drill 0.8)
  other vias: 70.67,18.21
N$132  (via drill 0.8)
  other vias: 72.56,20.31
N$133  (via drill 0.8)
  other vias: 72.57,18.23
R1
  Top 3.81: J5.1 36.45,13.33 34.64,15.14 34.64,20.89 34.52,21 34.52,20.39 Q4.3
R2
  Top 3.81: J5.2 31.45,10.6 25.16,16.88 Q3.3
R3
  Top 3.81: Q5.3 16.12,19.89 16.12,18.6 26.03,8.7 J6.1
RESET  (via drill 0.3)
  Top 0.305: U1.29 40.87,49.07 v40.87,49.92 | 32.25,50.04 C1.2 32.29,50 R3.1 32.29,49.07 v32.25,49.12 31.97,49.31 27.74,49.31 25.98,47.54 25.98,45.1 25.2,44.33 24.66,44.33 24.62,44.38 Q10.3
  Bottom 0.305: v40.87,49.92 33.06,49.92 v32.25,49.12
RXI
  Top 0.254: U1.30 40.07,49.45 38.8,50.72 38.8,52.43
  Top 0.305: J2.5 38.77,52.46 38.8,52.43
TXO
  Top 0.254: U1.31 39.27,49.58 36.73,52.11 36.58,52.11
  Top 0.305: 36.58,52.11 36.48,52.11 J2.4
V1
  Top 3.81: J6.2 17.98,7.22 5.57,19.7 6.27,19.64 7.05,20.43 6.45,20.43 Q6.3
V2
  Top 3.81: J4.2 52.29,8.85 61.63,18.18 61.63,20.8 61.49,20.94 61.49,20.31 Q1.3
V3  (1 unrouted)
  Top 3.81: J7.1 46.92,7.09 46.92,10.63 52.66,16.38 52.66,20.85 52.39,21.11 52.39,20.45 Q2.3
  Bottom 3.81: 46.92,7.09 46.84,10.56 52.67,16.35 52.71,20.69 52.66,20.75
VCC  (via drill 0.3, 0.6)  (1 unrouted)
  Top 0.305: U1.6 37.87,42 38.27,42.4 38.27,42.6 | 38.27,42.6 38.27,43.2 37.87,43.6 | 37.87,43.6 U1.4 34.68,43.6 C5.2 | 38.27,42.6 39.67,41.2 U1.18 C3.2 C6.2 | 37.87,43.6 39.17,43.6 v39.87,44.3 | v35.85,47.56 v35.84,47.56 34.52,47.56 R3.2 | K1.1 11.28,47.54 J1.-
  Top 0.406: C3.2 47.9,41.5
  Top 0.61: R1.2 C4.2 80.09,48.82 v79.99,48.93
  Top 0.813: C4.2
  Top 1.016: C10.+ 81.67,40.56 82.71,39.52 82.71,38.25 U2.2 U2.TER
  Bottom 0.305: v39.87,44.3 39.87,46.5 | 39.87,46.5 38.77,47.6 38.73,47.56 v35.85,47.56 | 44.47,50.97 44.34,50.97 39.87,46.5 | 11.4,53.27 11.28,53.15 J1.-
  Bottom 0.61: v79.99,48.93 60.6,48.94 58.25,51.28 58.25,52.44 J11.1 58.24,51.52 57.69,50.97 44.47,50.97 J3.1 41.31,54.13 29.13,54.13 28.52,53.52 | J2.1 28.52,53.52 | 28.52,53.52 27.86,54.18 12.3,54.18 11.4,53.27

### Text on the board
tNames: RED1 | RED1 | RED1 | AMBER | GREEN | BUZZER | RED1 | RED1 | C:/Users/jorge/Desktop/Sin título.bmp